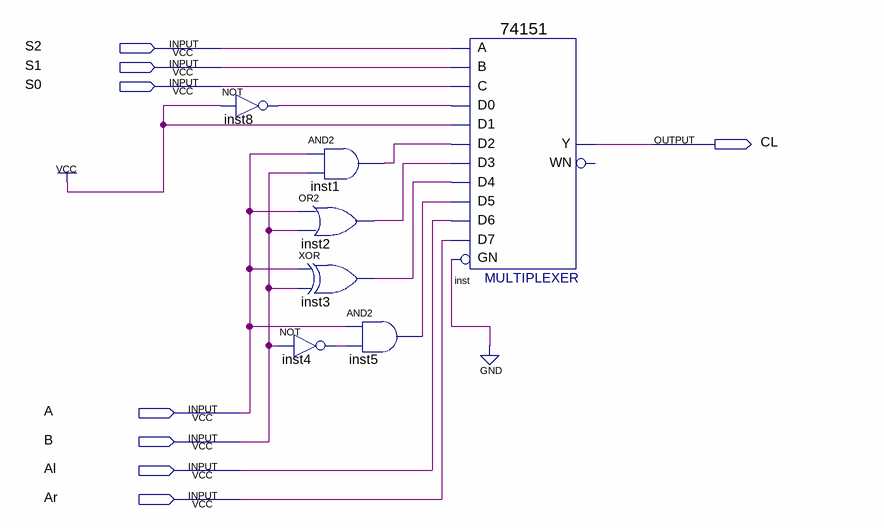
[diagram p0: schematic sheet]
// Quartus schematic 1bitLSC.bdf as structural Verilog: 7 symbols, 8 pins
module \1bitLSC  (
  input  S2,
  input  S1,
  input  S0,
  input  A,
  input  B,
  input  Al,
  input  Ar,
  output CL
);

  wire inst1_out, inst2_out, inst3_out, inst4_out, inst5_out, inst8_out;

  not inst8 (inst8_out, 1'b1);
  not inst4 (inst4_out, B);
  and inst1 (inst1_out, A, B);
  or inst2 (inst2_out, A, B);
  xor inst3 (inst3_out, A, B);
  and inst5 (inst5_out, A, inst4_out);
  \74151  inst (
    .GN(1'b0), .C(S0), .B(S1), .A(S2), .D5(inst5_out), .D0(inst8_out), .D1(1'b1), .D4(inst3_out),
    .D3(inst2_out), .D2(inst1_out), .D6(Al), .D7(Ar), .Y(CL));  // open: WN
endmodule
